# EAGLE schematic RectangularThing R2 (EAGLE 7.7.0)

## Sheet 1 of 6: Power & Modulation Routing
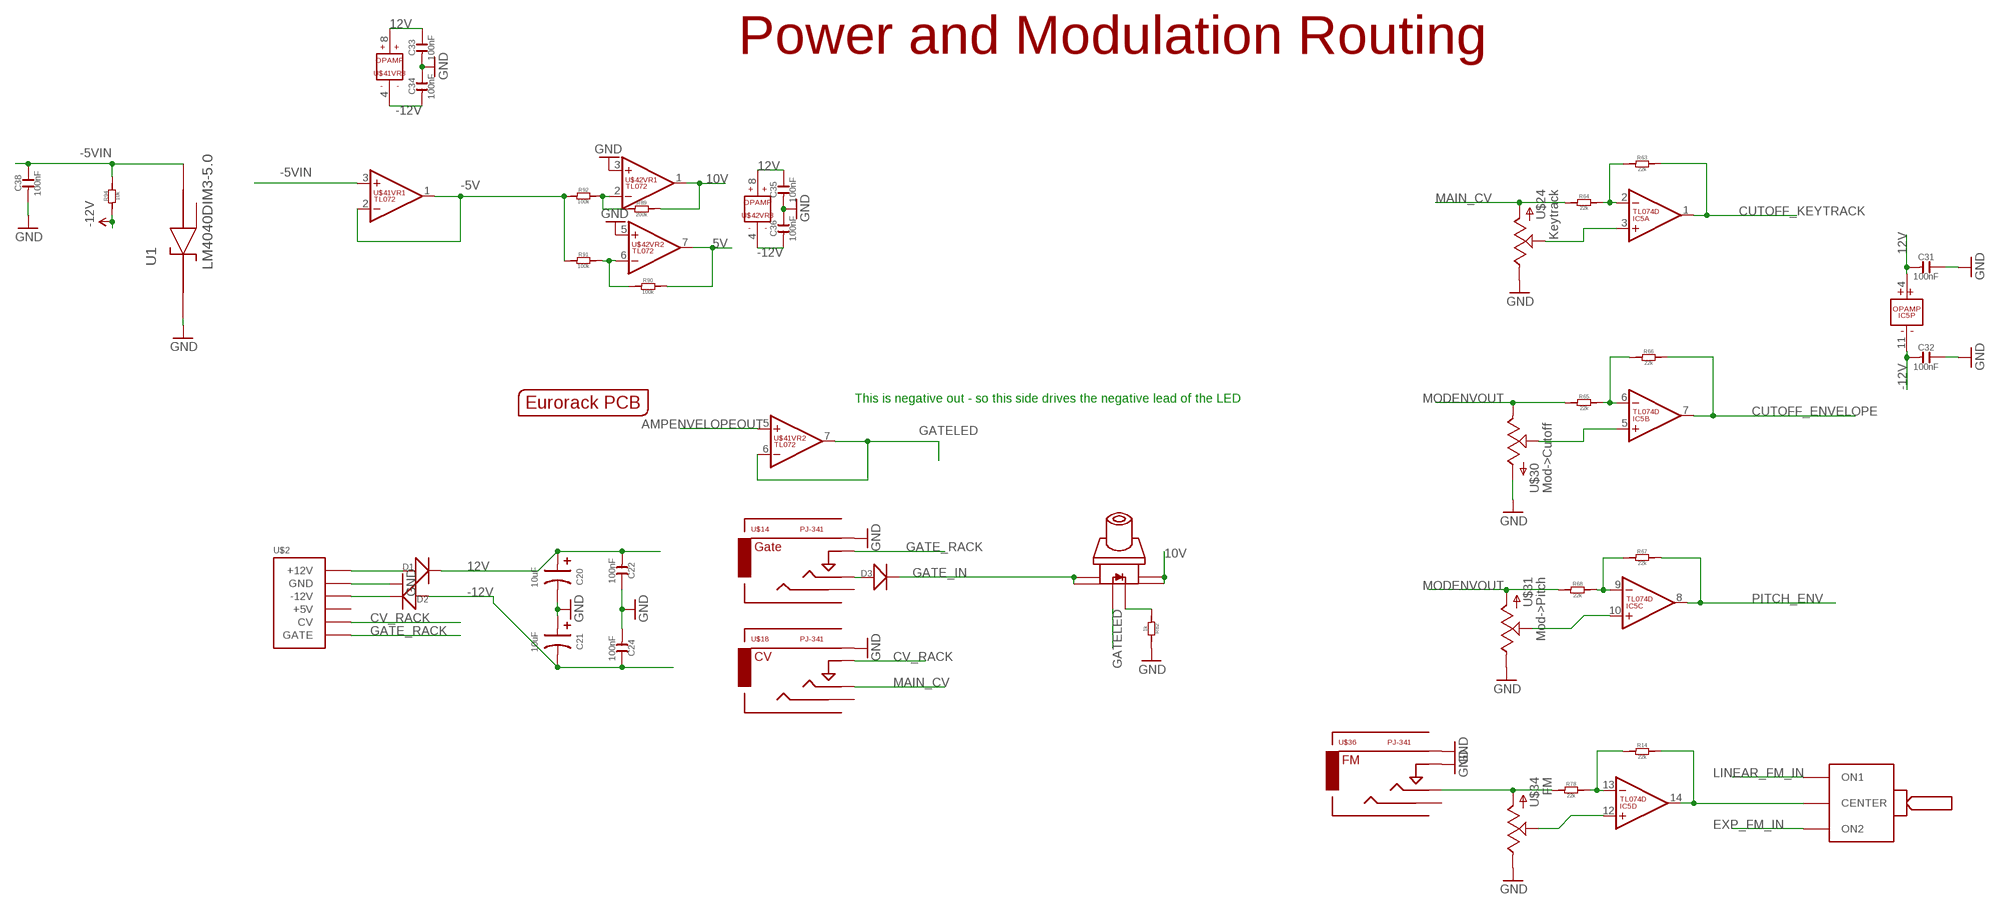
[diagram p0: schematic, sheet 1]

### Parts
C20  10uF  C-POLAR-A  [AVX-A]
C21  10uF  C-POLAR-A  [AVX-A]
C22  100nF  C-0603  [C0603]
C24  100nF  C-0603  [C0603]
C31  100nF  C-0603  [C0603]
C32  100nF  C-0603  [C0603]
C33  100nF  C-0603  [C0603]
C34  100nF  C-0603  [C0603]
C35  100nF  C-0603  [C0603]
C36  100nF  C-0603  [C0603]
C38  100nF  C-0603  [C0603]
D1  D-SMA  [DO-214AC]
D2  D-SMA  [DO-214AC]
D3  D-SMA  [DO-214AC]
IC5  TL074D  [SO14]
R14  22k  R-0603  [R0603]
R63  22k  R-0603  [R0603]
R64  22k  R-0603  [R0603]
R65  22k  R-0603  [R0603]
R66  22k  R-0603  [R0603]
R67  22k  R-0603  [R0603]
R68  22k  R-0603  [R0603]
R78  22k  R-0603  [R0603]
R82  1k  R-0603  [R0603]
R89  200k  R-0603  [R0603]
R90  100k  R-0603  [R0603]
R91  100k  R-0603  [R0603]
R92  100k  R-0603  [R0603]
R94  10k  R-0603  [R0603]
U1  LM4040DIM3-5.0  [SOT95P237X112-3N]
U$1  EURORACK_PCB20HP_10X10CM  [EURORACK20HP_10X10CM]
U$2  POWERSHROUDED  [POWER_16_SHROUDED]
U$14  PJ-341  AUDIO-JACKINPUT  [3.5MM-JACK-SWITCH-13MM-INPUT]
U$18  PJ-341  AUDIO-JACKINPUT  [3.5MM-JACK-SWITCH-13MM-INPUT]
U$24  POTZEPHPOT  [OG-POTS_ALPS_POT_VERTICAL]
U$30  POTZEPHPOT  [OG-POTS_ALPS_POT_VERTICAL]
U$31  POTZEPHPOT  [OG-POTS_ALPS_POT_VERTICAL]
U$34  POTZEPHPOT  [OG-POTS_ALPS_POT_VERTICAL]
U$35  ONOFFON  [MULTICOMP1MS-ONOFFON]
U$36  PJ-341  AUDIO-JACKINPUT  [3.5MM-JACK-SWITCH-13MM-INPUT]
U$39  SWITCH_W_LED_PB6149L-X-102YELLOW  [PB6149L]
U$41  TL072  [SO08]
U$42  TL072  [SO08]

### Nets
5V [power]: R90.2 U$42.7(VR2:OUT) ; also sheet 2,5,6
10V [power]: R89.2 U$39.3 U$39.4 U$42.1(VR1:OUT) ; also sheet 2,6
12V [power]: C20.+ C22.1 C31.1 C33.2 C35.2 D1.2(-) IC5.4(P:V+) U$41.8(VR3:V+) U$42.8(VR3:V+) ; also sheet 2,3,4,5,6
-5V [power]: R91.1 R92.1 U$41.1(VR1:OUT) U$41.2(VR1:-IN) ; also sheet 2,3,5,6
-5VIN [power]: C38.2 R94.2 U1.2(ANODE) U$41.3(VR1:+IN)
-12V [power]: C21.- C24.2 C32.1 C34.1 C36.1 D2.1(+) IC5.11(P:V-) R94.1 U$41.4(VR3:V-) U$42.4(VR3:V-) ; also sheet 2,3,4,5,6
AMPENVELOPEOUT: U$41.5(VR2:+IN) ; also sheet 4,5
CUTOFF_ENVELOPE: IC5.7(B:OUT) R66.2 ; also sheet 6
CUTOFF_KEYTRACK: IC5.1(A:OUT) R63.2 ; also sheet 6
CV_RACK: U$2.13(CV) U$2.14(CV) U$18.SWITCH@3(SWITCH)
EXP_FM_IN: U$35.3(ON2) ; also sheet 2
GATE_IN: D3.2(-) U$39.1 U$39.2 ; also sheet 5
GATE_RACK: U$2.15(GATE) U$2.16(GATE) U$14.SWITCH@3(SWITCH)
GATELED: U$39.LEDPOS(POS) U$41.6(VR2:-IN) U$41.7(VR2:OUT)
GND [power]: C20.- C21.+ C22.2 C24.1 C31.2 C32.2 C33.1 C34.2 C35.1 C36.2 C38.1 R82.2 U1.1(CATHODE) U$2.3(GND) U$2.4(GND) U$2.5(GND) U$2.6(GND) U$2.7(GND) U$2.8(GND) U$14.RING@3(RING) U$18.RING@3(RING) U$24.P$1(E) U$30.P$3(A) U$31.P$1(E) U$34.P$1(E) U$36.RING@3(RING) U$36.SWITCH@3(SWITCH) U$42.3(VR1:+IN) U$42.5(VR2:+IN) ; also sheet 2,3,4,5,6
LINEAR_FM_IN: U$35.1(ON1) ; also sheet 2
MAIN_CV: R64.1 U$18.TIP@3(TIP) U$24.P$3(A) ; also sheet 2
MODENVOUT: R65.1 R68.1 U$30.P$1(E) U$31.P$3(A) ; also sheet 5
N$7 [power]: D1.1(+) U$2.9(+12V) U$2.10(+12V)
N$8 [power]: D2.2(-) U$2.1(-12V) U$2.2(-12V)
N$22: R82.1 U$39.LEDNEG(NEG)
N$41: IC5.14(D:OUT) R14.2 U$35.2(CENTER)
N$66: IC5.13(D:-IN) R14.1 R78.2
N$67: IC5.2(A:-IN) R63.1 R64.2
N$68: IC5.3(A:+IN) U$24.P$2(S)
N$69: IC5.6(B:-IN) R65.2 R66.1
N$72: IC5.9(C:-IN) R67.1 R68.2
N$73: IC5.5(B:+IN) U$30.P$2(S)
N$78: IC5.10(C:+IN) U$31.P$2(S)
N$81: IC5.12(D:+IN) U$34.P$2(S)
N$82: R78.1 U$34.P$3(A) U$36.TIP@3(TIP)
N$86: D3.1(+) U$14.TIP@3(TIP)
N$91: R89.1 R92.2 U$42.2(VR1:-IN)
N$93: R90.1 R91.2 U$42.6(VR2:-IN)
PITCH_ENV: IC5.8(C:OUT) R67.2 ; also sheet 2
Unconnected: U1.3(NC) U$2.11(+5V) U$2.12(+5V) U$14.SECOND@3(SECOND) U$18.SECOND@3(SECOND) U$36.SECOND@3(SECOND)

### Notes on the sheet
- Power and Modulation Routing
- This is negative out - so this side drives the negative lead of the LED

## Sheet 2 of 6: Oscillator
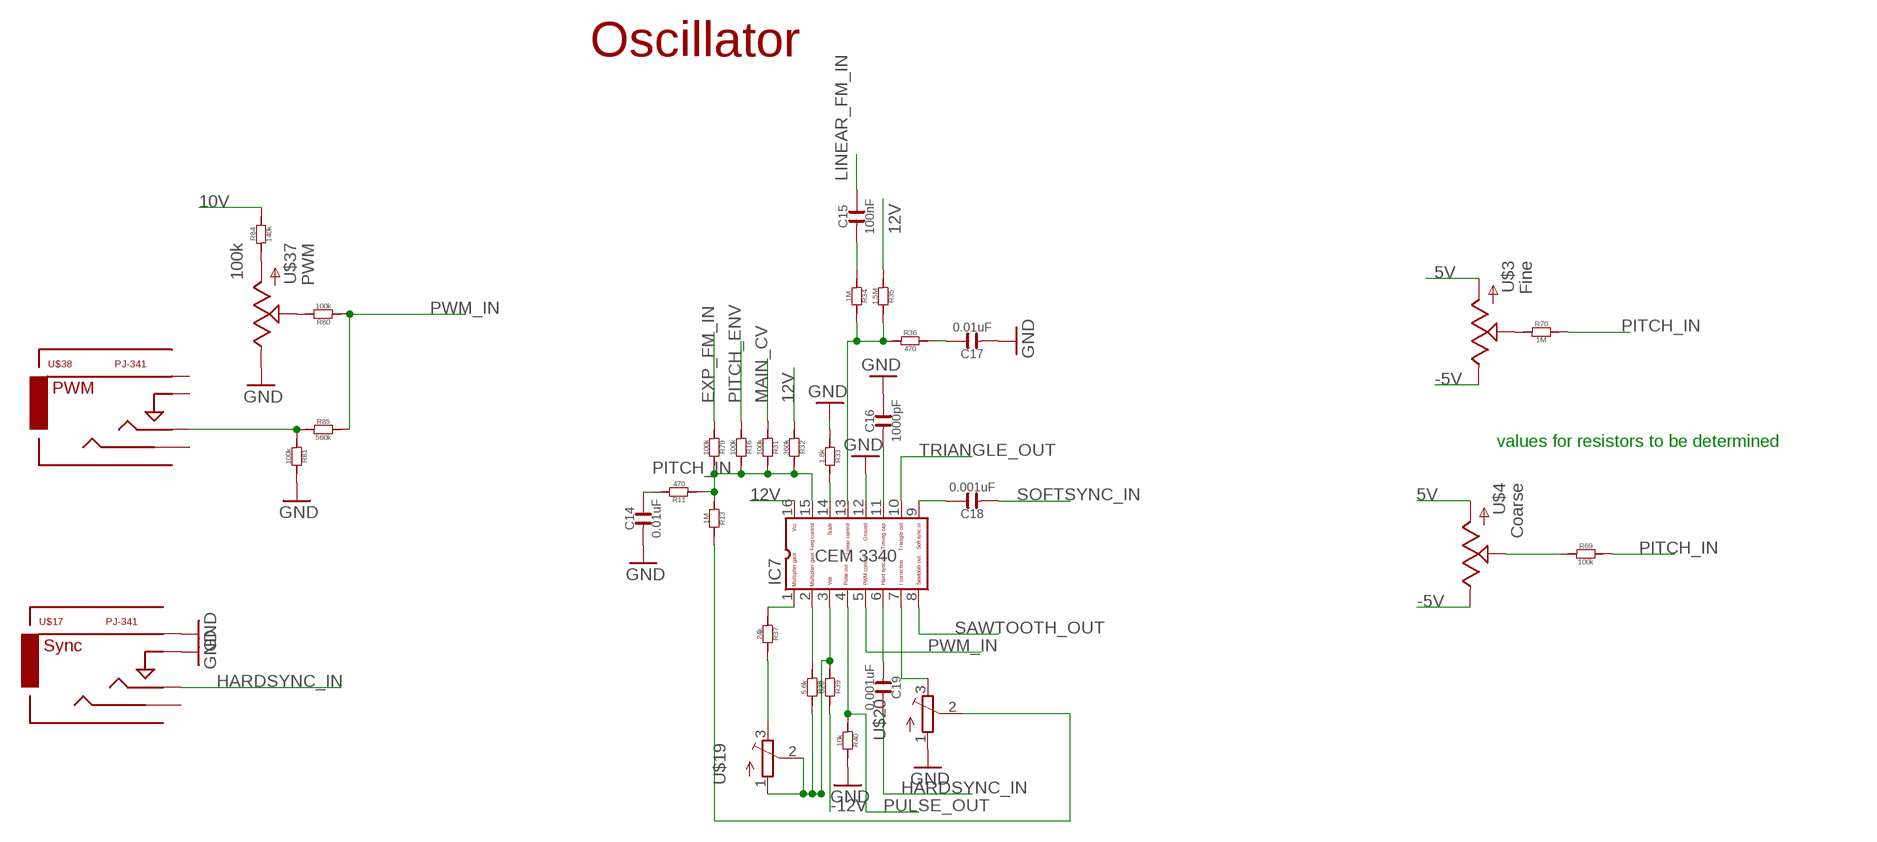
[diagram p1: schematic, sheet 2]

### Parts
C14  0.01uF  C-0603  [C0603]
C15  100nF  C-0603  [C0603]
C16  1000pF  C-0603  [C0603]
C17  0.01uF  C-0603  [C0603]
C18  0.001uF  C-0603  [C0603]
C19  0.001uF  C-0603  [C0603]
IC7  CEM3340  [DIL16]
R11  470  R-0603  [R0603]
R13  1M  R-0603  [R0603]
R16  100k  R-0603  [R0603]
R31  100k  R-0603  [R0603]
R32  360k  R-0603  [R0603]
R33  1.8k  R-0603  [R0603]
R34  1M  R-0603  [R0603]
R35  1.5M  R-0603  [R0603]
R36  470  R-0603  [R0603]
R37  24k  R-0603  [R0603]
R38  5.6k  R-0603  [R0603]
R39  820  R-0603  [R0603]
R40  10k  R-0603  [R0603]
R69  100k  R-0603  [R0603]
R70  1M  R-0603  [R0603]
R79  100k  R-0603  [R0603]
R80  100k  R-0603  [R0603]
R81  100k  R-0603  [R0603]
R84  140k  R-0603  [R0603]
R85  560k  R-0603  [R0603]
U$3  POTZEPHPOT  [OG-POTS_ALPS_POT_VERTICAL]
U$4  POTZEPHPOT  [OG-POTS_ALPS_POT_VERTICAL]
U$17  PJ-341  AUDIO-JACKINPUT  [3.5MM-JACK-SWITCH-13MM-INPUT]
U$19  TRIMPOTTC33X  [TC33X]
U$20  TRIMPOTTC33X  [TC33X]
U$37  100k  POTZEPHPOT  [OG-POTS_ALPS_POT_VERTICAL]
U$38  PJ-341  AUDIO-JACKINPUT  [3.5MM-JACK-SWITCH-13MM-INPUT]

### Nets
5V [power]: U$3.P$3(A) U$4.P$3(A) ; also sheet 1,5,6
10V [power]: R84.2 ; also sheet 1,6
12V [power]: IC7.16 R32.1 R35.1 ; also sheet 1,3,4,5,6
-5V [power]: U$3.P$1(E) U$4.P$1(E) ; also sheet 1,3,5,6
-12V [power]: R39.2 ; also sheet 1,3,4,5,6
EXP_FM_IN: R79.1 ; also sheet 1
GND [power]: C14.1 C16.2 C17.1 IC7.12 R33.1 R40.2 R81.2 U$17.RING@3(RING) U$17.SWITCH@3(SWITCH) U$20.1(A) U$37.P$1(E) ; also sheet 1,3,4,5,6
HARDSYNC_IN: C19.2 U$17.TIP@3(TIP)
LINEAR_FM_IN: C15.2 ; also sheet 1
MAIN_CV: R31.1 ; also sheet 1
N$16: C14.2 R11.2
N$31: C17.2 R36.2
N$34: IC7.13 R34.2 R35.2 R36.1
N$35: C15.1 R34.1
N$36: C16.1 IC7.11
N$37: C18.2 IC7.9
N$38: IC7.14 R33.2
N$42: C19.1 IC7.6
N$43: IC7.1 R37.1
N$44: R37.2 U$19.3(E)
N$45: IC7.3 R38.2 R39.1 U$19.1(A) U$19.2(S)
N$46: R13.2 U$20.2(S)
N$47: IC7.2 R38.1
N$48: IC7.7 U$20.3(E)
N$79: R69.1 U$4.P$2(S)
N$80: R70.1 U$3.P$2(S)
N$83: R80.2 U$37.P$2(S)
N$84: R84.1 U$37.P$3(A)
N$85: R81.1 R85.1 U$38.TIP@3(TIP)
PITCH_ENV: R16.1 ; also sheet 1
PITCH_IN: IC7.15 R11.1 R13.1 R16.2 R31.2 R32.2 R69.2 R70.2 R79.2
PULSE_OUT: IC7.4 R40.1 ; also sheet 3
PWM_IN: IC7.5 R80.1 R85.2
SAWTOOTH_OUT: IC7.8 ; also sheet 3
SOFTSYNC_IN: C18.1
TRIANGLE_OUT: IC7.10 ; also sheet 3
Unconnected: U$17.SECOND@3(SECOND) U$38.RING@3(RING) U$38.SECOND@3(SECOND) U$38.SWITCH@3(SWITCH)

### Notes on the sheet
- Oscillator
- values for resistors to be determined

## Sheet 3 of 6: Mixer
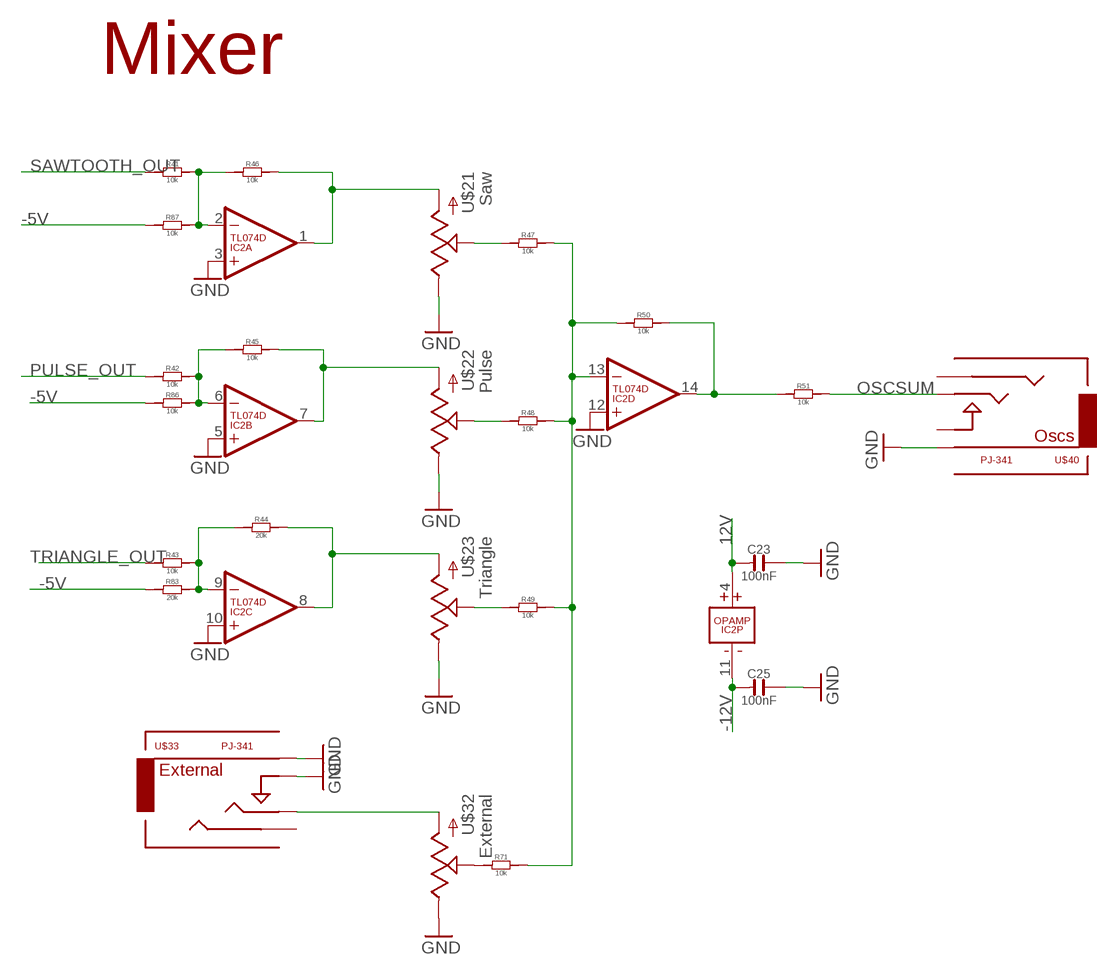
[diagram p2: schematic, sheet 3]

### Parts
C23  100nF  C-0603  [C0603]
C25  100nF  C-0603  [C0603]
IC2  TL074D  [SO14]
R41  10k  R-0603  [R0603]
R42  10k  R-0603  [R0603]
R43  10k  R-0603  [R0603]
R44  20k  R-0603  [R0603]
R45  10k  R-0603  [R0603]
R46  10k  R-0603  [R0603]
R47  10k  R-0603  [R0603]
R48  10k  R-0603  [R0603]
R49  10k  R-0603  [R0603]
R50  10k  R-0603  [R0603]
R51  10k  R-0603  [R0603]
R71  10k  R-0603  [R0603]
R83  20k  R-0603  [R0603]
R86  10k  R-0603  [R0603]
R87  10k  R-0603  [R0603]
U$21  POTZEPHPOT  [OG-POTS_ALPS_POT_VERTICAL]
U$22  POTZEPHPOT  [OG-POTS_ALPS_POT_VERTICAL]
U$23  POTZEPHPOT  [OG-POTS_ALPS_POT_VERTICAL]
U$32  POTZEPHPOT  [OG-POTS_ALPS_POT_VERTICAL]
U$33  PJ-341  AUDIO-JACKINPUT  [3.5MM-JACK-SWITCH-13MM-INPUT]
U$40  PJ-341  AUDIO-JACKOUTPUT  [3.5MM-JACK-SWITCH-13MM-OUTPUT]

### Nets
12V [power]: C23.1 IC2.4(P:V+) ; also sheet 1,2,4,5,6
-5V [power]: R83.1 R86.1 R87.1 ; also sheet 1,2,5,6
-12V [power]: C25.1 IC2.11(P:V-) ; also sheet 1,2,4,5,6
GND [power]: C23.2 C25.2 IC2.3(A:+IN) IC2.5(B:+IN) IC2.10(C:+IN) IC2.12(D:+IN) U$21.P$1(E) U$22.P$1(E) U$23.P$1(E) U$32.P$1(E) U$33.RING@3(RING) U$33.SWITCH@3(SWITCH) U$40.RING@3(RING) ; also sheet 1,2,4,5,6
N$39: IC2.14(D:OUT) R50.2 R51.1
N$40: IC2.13(D:-IN) R47.2 R48.2 R49.2 R50.1 R71.2
N$49: R49.1 U$23.P$2(S)
N$50: R48.1 U$22.P$2(S)
N$51: R47.1 U$21.P$2(S)
N$52: IC2.1(A:OUT) R46.2 U$21.P$3(A)
N$53: IC2.7(B:OUT) R45.2 U$22.P$3(A)
N$54: IC2.6(B:-IN) R42.2 R45.1 R86.2
N$55: IC2.2(A:-IN) R41.2 R46.1 R87.2
N$56: IC2.9(C:-IN) R43.2 R44.1 R83.2
N$57: IC2.8(C:OUT) R44.2 U$23.P$3(A)
N$75: R71.1 U$32.P$2(S)
N$76: U$32.P$3(A) U$33.TIP@3(TIP)
OSCSUM: R51.2 U$40.TIP@3(TIP) ; also sheet 4,6
PULSE_OUT: R42.1 ; also sheet 2
SAWTOOTH_OUT: R41.1 ; also sheet 2
TRIANGLE_OUT: R43.1 ; also sheet 2
Unconnected: U$33.SECOND@3(SECOND) U$40.SECOND@3(SECOND) U$40.SWITCH@3(SWITCH)

### Notes on the sheet
- Mixer

## Sheet 4 of 6: VCA
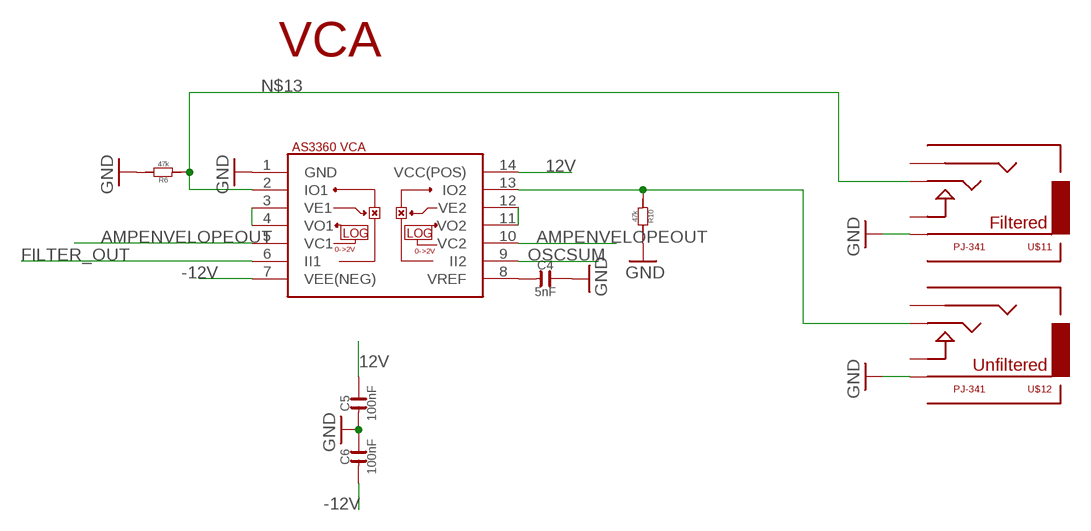
[diagram p3: schematic, sheet 4]

### Parts
C4  5nF  C-0603  [C0603]
C5  100nF  C-0603  [C0603]
C6  100nF  C-0603  [C0603]
R6  47k  R-0603  [R0603]
R10  47k  R-0603  [R0603]
U$11  PJ-341  AUDIO-JACKOUTPUT  [3.5MM-JACK-SWITCH-13MM-OUTPUT]
U$12  PJ-341  AUDIO-JACKOUTPUT  [3.5MM-JACK-SWITCH-13MM-OUTPUT]
U$15  CEM3360  [DIL14]

### Nets
12V [power]: C5.2 U$15.14(VCC(POS)) ; also sheet 1,2,3,5,6
-12V [power]: C6.1 U$15.7(VEE(NEG)) ; also sheet 1,2,3,5,6
AMPENVELOPEOUT: U$15.5(VC1) U$15.10(VC2) ; also sheet 1,5
FILTER_OUT: U$15.6(II1) ; also sheet 6
GND [power]: C4.2 C5.1 C6.2 R6.2 R10.2 U$11.RING@3(RING) U$12.RING@3(RING) U$15.1(GND) ; also sheet 1,2,3,5,6
N$5: C4.1 U$15.8(VREF)
N$12: U$15.3(VE1) U$15.4(VO1)
N$13: R6.1 U$11.TIP@3(TIP) U$15.2(IO1)
N$14: R10.1 U$12.TIP@3(TIP) U$15.13(IO2)
N$15: U$15.11(VO2) U$15.12(VE2)
OSCSUM: U$15.9(II2) ; also sheet 3,6
Unconnected: U$11.SECOND@3(SECOND) U$11.SWITCH@3(SWITCH) U$12.SECOND@3(SECOND) U$12.SWITCH@3(SWITCH)

### Notes on the sheet
- VCA

## Sheet 5 of 6: Envelopes
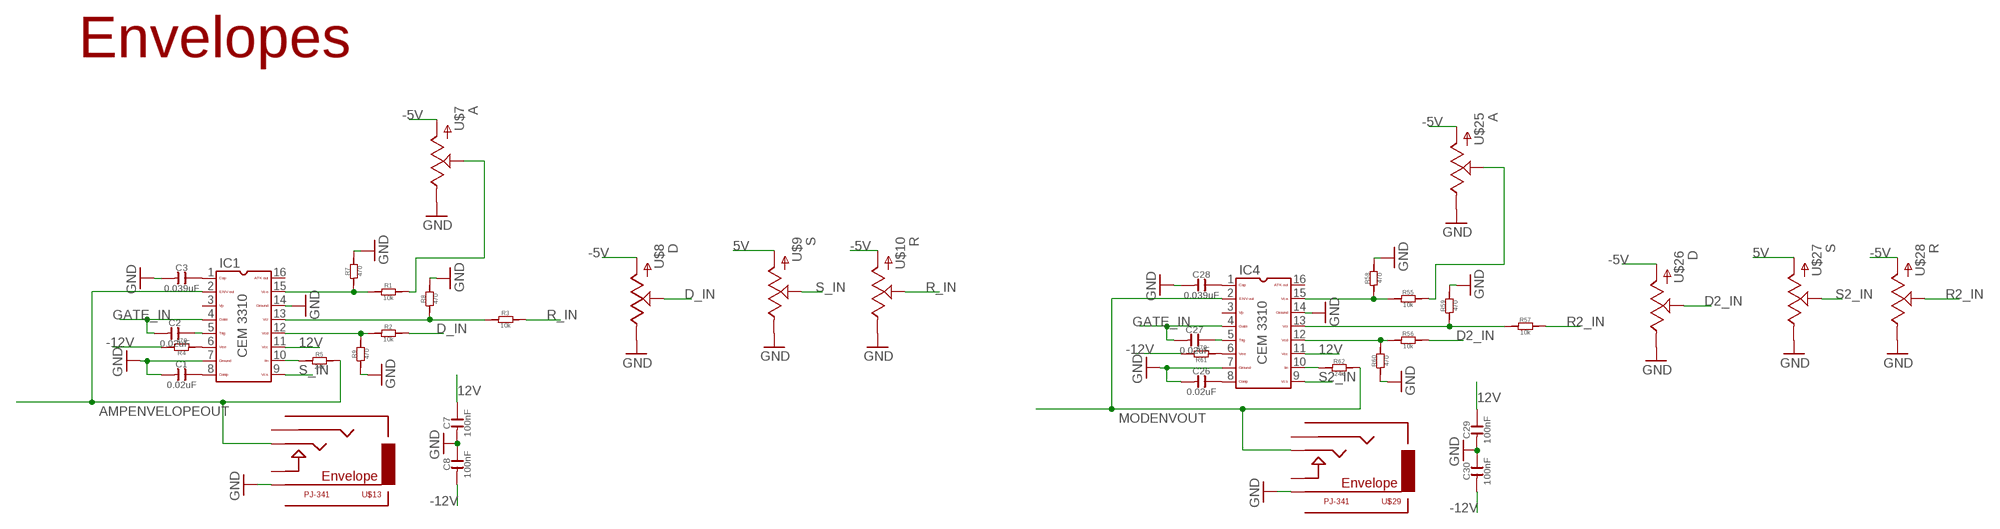
[diagram p4: schematic, sheet 5]

### Parts
C1  0.02uF  C-0603  [C0603]
C2  0.02uF  C-0603  [C0603]
C3  0.039uF  C-0603  [C0603]
C7  100nF  C-0603  [C0603]
C8  100nF  C-0603  [C0603]
C26  0.02uF  C-0603  [C0603]
C27  0.02uF  C-0603  [C0603]
C28  0.039uF  C-0603  [C0603]
C29  100nF  C-0603  [C0603]
C30  100nF  C-0603  [C0603]
IC1  CEM3310  [DIL16]
IC4  CEM3310  [DIL16]
R1  10k  R-0603  [R0603]
R2  10k  R-0603  [R0603]
R3  10k  R-0603  [R0603]
R4  470  R-0603  [R0603]
R5  24k  R-0603  [R0603]
R7  470  R-0603  [R0603]
R8  470  R-0603  [R0603]
R9  470  R-0603  [R0603]
R55  10k  R-0603  [R0603]
R56  10k  R-0603  [R0603]
R57  10k  R-0603  [R0603]
R58  470  R-0603  [R0603]
R59  470  R-0603  [R0603]
R60  470  R-0603  [R0603]
R61  470  R-0603  [R0603]
R62  24k  R-0603  [R0603]
U$7  POTZEPHPOT  [OG-POTS_ALPS_POT_VERTICAL]
U$8  POTZEPHPOT  [OG-POTS_ALPS_POT_VERTICAL]
U$9  POTZEPHPOT  [OG-POTS_ALPS_POT_VERTICAL]
U$10  POTZEPHPOT  [OG-POTS_ALPS_POT_VERTICAL]
U$13  PJ-341  AUDIO-JACKOUTPUT  [3.5MM-JACK-SWITCH-13MM-OUTPUT]
U$25  POTZEPHPOT  [OG-POTS_ALPS_POT_VERTICAL]
U$26  POTZEPHPOT  [OG-POTS_ALPS_POT_VERTICAL]
U$27  POTZEPHPOT  [OG-POTS_ALPS_POT_VERTICAL]
U$28  POTZEPHPOT  [OG-POTS_ALPS_POT_VERTICAL]
U$29  PJ-341  AUDIO-JACKOUTPUT  [3.5MM-JACK-SWITCH-13MM-OUTPUT]

### Nets
5V [power]: U$9.P$3(A) U$27.P$3(A) ; also sheet 1,2,6
12V [power]: C7.2 C29.2 IC1.11 IC4.11 ; also sheet 1,2,3,4,6
-5V [power]: U$7.P$3(A) U$8.P$3(A) U$10.P$3(A) U$25.P$3(A) U$26.P$3(A) U$28.P$3(A) ; also sheet 1,2,3,6
-12V [power]: C8.1 C30.1 R4.2 R61.2 ; also sheet 1,2,3,4,6
A2_IN: R55.2 U$25.P$2(S)
A_IN: R1.2 U$7.P$2(S)
AMPENVELOPEOUT: IC1.2 R5.2 U$13.TIP@3(TIP) ; also sheet 1,4
D2_IN: R56.2 U$26.P$2(S)
D_IN: R2.2 U$8.P$2(S)
GATE_IN: C2.1 C27.1 IC1.4 IC4.4 ; also sheet 1
GND [power]: C1.1 C3.1 C7.1 C8.2 C26.1 C28.1 C29.1 C30.2 IC1.7 IC1.14 IC4.7 IC4.14 R7.2 R8.2 R9.1 R58.2 R59.2 R60.1 U$7.P$1(E) U$8.P$1(E) U$9.P$1(E) U$10.P$1(E) U$13.RING@3(RING) U$25.P$1(E) U$26.P$1(E) U$27.P$1(E) U$28.P$1(E) U$29.RING@3(RING) ; also sheet 1,2,3,4,6
MODENVOUT: IC4.2 R62.2 U$29.TIP@3(TIP) ; also sheet 1
N$1: IC1.15 R1.1 R7.1
N$2: IC1.12 R2.1 R9.2
N$3: IC1.13 R3.1 R8.1
N$4: C3.2 IC1.1
N$6: C2.2 IC1.5
N$9: IC1.6 R4.1
N$10: C1.2 IC1.8
N$11: IC1.10 R5.1
N$58: IC4.15 R55.1 R58.1
N$59: IC4.12 R56.1 R60.2
N$60: IC4.13 R57.1 R59.1
N$61: C27.2 IC4.5
N$62: IC4.6 R61.1
N$63: C26.2 IC4.8
N$64: IC4.10 R62.1
N$65: C28.2 IC4.1
R2_IN: R57.2 U$28.P$2(S)
R_IN: R3.2 U$10.P$2(S)
S2_IN: IC4.9 U$27.P$2(S)
S_IN: IC1.9 U$9.P$2(S)
Unconnected: IC1.3 IC1.16 IC4.3 IC4.16 U$13.SECOND@3(SECOND) U$13.SWITCH@3(SWITCH) U$29.SECOND@3(SECOND) U$29.SWITCH@3(SWITCH)

### Notes on the sheet
- Envelopes

## Sheet 6 of 6: Filter
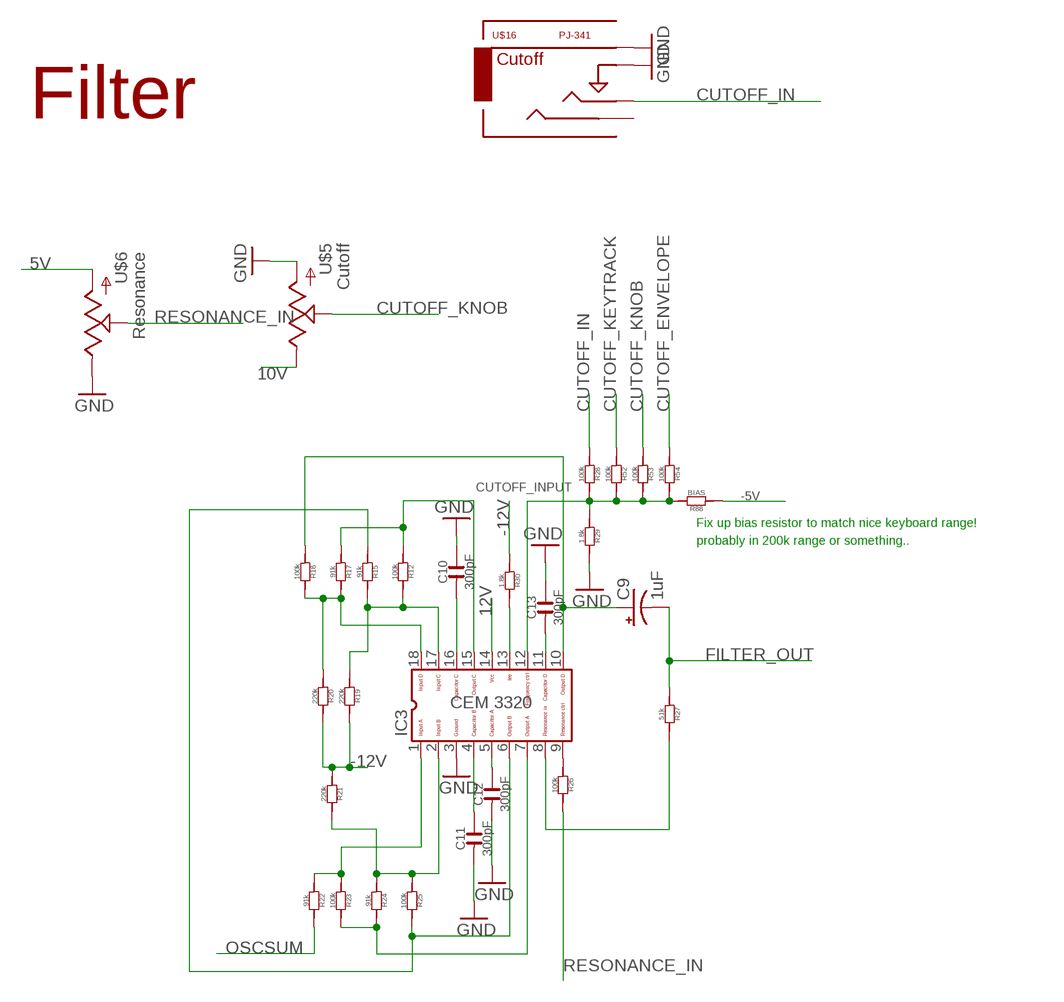
[diagram p5: schematic, sheet 6]

### Parts
C9  1uF  CPOL-US153CLV-0505  [153CLV-0505]
C10  300pF  C-0603  [C0603]
C11  300pF  C-0603  [C0603]
C12  300pF  C-0603  [C0603]
C13  300pF  C-0603  [C0603]
IC3  CEM3320  [DIL18]
R12  100k  R-0603  [R0603]
R15  91k  R-0603  [R0603]
R17  91k  R-0603  [R0603]
R18  100k  R-0603  [R0603]
R19  220k  R-0603  [R0603]
R20  220k  R-0603  [R0603]
R21  220k  R-0603  [R0603]
R22  91k  R-0603  [R0603]
R23  100k  R-0603  [R0603]
R24  91k  R-0603  [R0603]
R25  100k  R-0603  [R0603]
R26  100k  R-0603  [R0603]
R27  51k  R-0603  [R0603]
R28  100k  R-0603  [R0603]
R29  1.8k  R-0603  [R0603]
R30  1.8k  R-0603  [R0603]
R52  100k  R-0603  [R0603]
R53  100k  R-0603  [R0603]
R54  100k  R-0603  [R0603]
R88  BIAS  R-0603  [R0603]
U$5  POTZEPHPOT  [OG-POTS_ALPS_POT_VERTICAL]
U$6  POTZEPHPOT  [OG-POTS_ALPS_POT_VERTICAL]
U$16  PJ-341  AUDIO-JACKINPUT  [3.5MM-JACK-SWITCH-13MM-INPUT]

### Nets
5V [power]: U$6.P$3(A) ; also sheet 1,2,5
10V [power]: U$5.P$1(E) ; also sheet 1,2
12V [power]: IC3.14 ; also sheet 1,2,3,4,5
-5V [power]: R88.1 ; also sheet 1,2,3,5
-12V [power]: R19.2 R20.2 R21.1 R30.1 ; also sheet 1,2,3,4,5
CUTOFF_ENVELOPE: R54.1 ; also sheet 1
CUTOFF_IN: R28.1 U$16.TIP@3(TIP)
CUTOFF_INPUT: IC3.12 R28.2 R29.1 R52.2 R53.2 R54.2 R88.2
CUTOFF_KEYTRACK: R52.1 ; also sheet 1
CUTOFF_KNOB: R53.1 U$5.P$2(S)
FILTER_OUT: C9.- R27.1 ; also sheet 4
GND [power]: C10.2 C11.1 C12.1 C13.2 IC3.3 R29.2 U$5.P$3(A) U$6.P$1(E) U$16.RING@3(RING) U$16.SWITCH@3(SWITCH) ; also sheet 1,2,3,4,5
N$17: C10.1 IC3.16
N$18: C11.2 IC3.4
N$19: C12.2 IC3.5
N$20: C13.1 IC3.11
N$21: IC3.9 R26.1
N$23: IC3.1 R22.1 R23.1
N$24: IC3.7 R23.2 R24.2
N$25: IC3.6 R15.1 R25.2
N$26: IC3.18 R17.2 R18.2 R20.1
N$27: IC3.17 R12.2 R15.2 R19.1
N$28: IC3.15 R12.1 R17.1
N$29: IC3.13 R30.2
N$30: C9.+ IC3.10 R18.1
N$32: IC3.8 R27.2
N$33: IC3.2 R21.2 R24.1 R25.1
OSCSUM: R22.2 ; also sheet 3,4
RESONANCE_IN: R26.2 U$6.P$2(S)
Unconnected: U$16.SECOND@3(SECOND)

### Notes on the sheet
- Filter
- Fix up bias resistor to match nice keyboard range!
- probably in 200k range or something..

## Library data of the parts
C1-C8 C10-C19 C22-C36 = OPL:C*
C9 = adafruit:CPOL-US: POLARIZED CAPACITOR, American symbol
C20 C21 = EurorackModularParts:C-POLAR*
C38 = OPL:C*; MF: AVX; MPN: 06035C104KAT2A; OC_FARNELL: 1301804
D1-D3 = OPL:D*: DIODE
IC1 IC4 = CEM:CEM3310: CEM 3310 VCEG
IC2 IC5 = EurorackModularParts:TL074: OP AMP
IC3 = CEM:CEM3320: CEM 3330 VCF
IC7 = CEM:CEM3340: CEM 3340 VCO
R1-R71 R78-R92 = OPL:R*
R94 = OPL:R*; OC_FARNELL: unknown
U1 = FarnellThings:LM4040DIM3-5.0: IC, Precision Micropower Shunt Voltage Reference, 5V,SOT-23-3; MF: TEXAS INSTRUMENTS; MPN: LM4040DIM3-5.0; OC_FARNELL: 9778330; OC_NEWARK: 97K3489; PACKAGE: SOT-23-3; SUPPLIER: TEXAS INSTRUMENTS
U$1 = EurorackModularParts:EURORACK_PCB
U$2 = EurorackModularParts:POWER
U$3 = EurorackModularParts:POT; DESC: Fine
U$4 = EurorackModularParts:POT; DESC: Coarse
U$5 = EurorackModularParts:POT; DESC: Cutoff
U$6 = EurorackModularParts:POT; DESC: Resonance
U$7 U$25 = EurorackModularParts:POT; DESC: A
U$8 U$26 = EurorackModularParts:POT; DESC: D
U$9 U$27 = EurorackModularParts:POT; DESC: S
U$10 U$28 = EurorackModularParts:POT; DESC: R
U$11 = EurorackModularParts:AUDIO-JACK: Switching Mono 3.5mm Audio Jack from Erthenvar.; DESC: Filtered; MPN: PJ-341
U$12 = EurorackModularParts:AUDIO-JACK: Switching Mono 3.5mm Audio Jack from Erthenvar.; DESC: Unfiltered; MPN: PJ-341
U$13 U$29 = EurorackModularParts:AUDIO-JACK: Switching Mono 3.5mm Audio Jack from Erthenvar.; DESC: Envelope; MPN: PJ-341
U$14 = EurorackModularParts:AUDIO-JACK: Switching Mono 3.5mm Audio Jack from Erthenvar.; DESC: Gate; MPN: PJ-341
U$15 = CEM:CEM3360
U$16 = EurorackModularParts:AUDIO-JACK: Switching Mono 3.5mm Audio Jack from Erthenvar.; DESC: Cutoff; MPN: PJ-341
U$17 = EurorackModularParts:AUDIO-JACK: Switching Mono 3.5mm Audio Jack from Erthenvar.; DESC: Sync; MPN: PJ-341
U$18 = EurorackModularParts:AUDIO-JACK: Switching Mono 3.5mm Audio Jack from Erthenvar.; DESC: CV; MPN: PJ-341
U$19 U$20 = adafruit:TRIMPOT: SMT trimmer potentiometer part number TC33X http://www.ladyada.net/library/eagle
U$21 = EurorackModularParts:POT; DESC: Saw
U$22 = EurorackModularParts:POT; DESC: Pulse
U$23 = EurorackModularParts:POT; DESC: Triangle
U$24 = EurorackModularParts:POT; DESC: Keytrack
U$30 = EurorackModularParts:POT; DESC: Mod->Cutoff
U$31 = EurorackModularParts:POT; DESC: Mod->Pitch
U$32 = EurorackModularParts:POT; DESC: External
U$33 = EurorackModularParts:AUDIO-JACK: Switching Mono 3.5mm Audio Jack from Erthenvar.; DESC: External; MPN: PJ-341
U$34 = EurorackModularParts:POT; DESC: FM
U$35 = EurorackModularParts:ONOFFON
U$36 = EurorackModularParts:AUDIO-JACK: Switching Mono 3.5mm Audio Jack from Erthenvar.; DESC: FM; MPN: PJ-341
U$37 = EurorackModularParts:POT; DESC: PWM
U$38 = EurorackModularParts:AUDIO-JACK: Switching Mono 3.5mm Audio Jack from Erthenvar.; DESC: PWM; MPN: PJ-341
U$39 = zephod-components:SWITCH_W_LED_PB6149L-X-102
U$40 = EurorackModularParts:AUDIO-JACK: Switching Mono 3.5mm Audio Jack from Erthenvar.; DESC: Oscs; MPN: PJ-341
U$41 U$42 = EurorackModularParts:TL072

## Net classes
0 default: width 0.305 mm
1 power: width 0.508 mm
3 groundplane: width 0.203 mm, clearance 0.203 mm